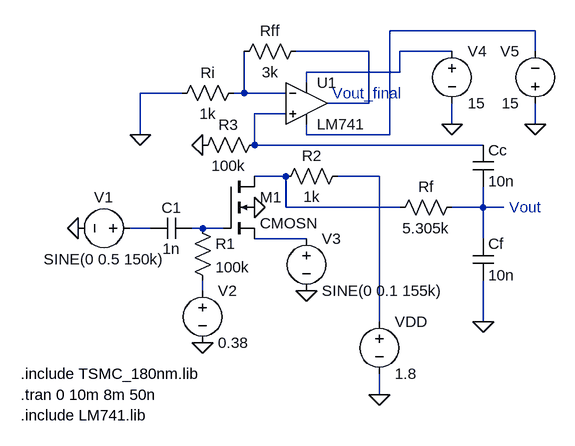
[diagram p0: schematic mixer+LPF+amplifier.asc]
mixer+LPF+amplifier.asc, the LTspice schematic file:
Version 4
SHEET 1 880 680
WIRE 640 -128 416 -128
WIRE 384 -96 272 -96
WIRE 512 -96 432 -96
WIRE 640 -96 640 -128
WIRE 432 -64 432 -96
WIRE 432 -64 288 -64
WIRE 288 -48 288 -64
WIRE 96 -32 32 -32
WIRE 192 -32 192 -96
WIRE 192 -32 176 -32
WIRE 256 -32 192 -32
WIRE 384 -16 384 -96
WIRE 384 -16 320 -16
WIRE 256 0 208 0
WIRE 512 16 512 -16
WIRE 640 16 640 -16
WIRE 32 32 32 -32
WIRE 288 32 288 16
WIRE 416 32 416 -128
WIRE 416 32 288 32
WIRE 208 48 208 0
WIRE 560 48 208 48
WIRE 256 96 208 96
WIRE 400 96 336 96
WIRE 256 144 256 96
WIRE 432 144 256 144
WIRE 560 144 560 112
WIRE 560 144 512 144
WIRE 592 144 560 144
WIRE 48 176 16 176
WIRE 128 176 112 176
WIRE 160 176 128 176
WIRE 288 192 208 192
WIRE 560 192 560 144
WIRE 128 272 128 256
WIRE 400 320 400 96
WIRE 560 320 560 256
WIRE 400 432 400 400
FLAG -64 176 0
FLAG 128 352 0
FLAG 288 272 0
FLAG 208 144 0
FLAG 560 320 0
FLAG 400 432 0
FLAG 32 32 0
FLAG 512 16 0
FLAG 640 16 0
FLAG 128 48 0
SYMBOL nmos4 160 96 R0
SYMATTR InstName M1
SYMATTR Value CMOSN
SYMATTR Value2 l=0.18u w=10u ad=5p as=5p pd=21u ps=21u
SYMBOL cap 112 160 R90
WINDOW 0 0 32 VBottom 2
WINDOW 3 32 32 VTop 2
SYMATTR InstName C1
SYMATTR Value 1n
SYMBOL res 112 160 R0
SYMATTR InstName R1
SYMATTR Value 100k
SYMBOL res 352 80 R90
WINDOW 0 0 56 VBottom 2
WINDOW 3 32 56 VTop 2
SYMATTR InstName R2
SYMATTR Value 1k
SYMBOL voltage 32 176 R90
WINDOW 0 -32 56 VBottom 2
WINDOW 3 32 56 VTop 2
WINDOW 123 0 0 Left 0
WINDOW 39 0 0 Left 0
SYMATTR InstName V1
SYMATTR Value SINE(0 0.5 150k)
SYMBOL voltage 128 256 R0
WINDOW 123 0 0 Left 0
WINDOW 39 0 0 Left 0
SYMATTR InstName V2
SYMATTR Value 0.38
SYMBOL voltage 288 176 R0
WINDOW 123 0 0 Left 0
WINDOW 39 0 0 Left 0
SYMATTR InstName V3
SYMATTR Value SINE(0 0.1 155k)
SYMBOL Res 528 128 R90
WINDOW 0 0 56 VBottom 2
WINDOW 3 32 56 VTop 2
SYMATTR InstName Rf
SYMATTR Value 5.305k
SYMBOL Cap 544 192 R0
SYMATTR InstName Cf
SYMATTR Value 10n
SYMBOL Voltage 400 304 R0
SYMATTR InstName VDD
SYMATTR Value 1.8
SYMBOL Cap 544 48 R0
SYMATTR InstName Cc
SYMATTR Value 10n
SYMBOL LM741 288 -80 R0
SYMATTR InstName U1
SYMBOL Res 192 -48 R90
WINDOW 0 0 56 VBottom 2
WINDOW 3 32 56 VTop 2
SYMATTR InstName Ri
SYMATTR Value 1k
SYMBOL Res 288 -112 R90
WINDOW 0 0 56 VBottom 2
WINDOW 3 32 56 VTop 2
SYMATTR InstName Rff
SYMATTR Value 3k
SYMBOL Voltage 512 -112 R0
SYMATTR InstName V4
SYMATTR Value 15
SYMBOL Voltage 640 0 R180
WINDOW 0 24 96 Left 2
WINDOW 3 24 16 Left 2
SYMATTR InstName V5
SYMATTR Value 15
SYMBOL Res 224 32 R90
WINDOW 0 0 56 VBottom 2
WINDOW 3 32 56 VTop 2
SYMATTR InstName R3
SYMATTR Value 100k
TEXT -152 400 Left 2 !.include TSMC_180nm.lib
TEXT -152 432 Left 2 !.tran 0 10m 8m 50n
TEXT -152 464 Left 2 !.include LM741.lib
TEXT 328 -32 Left 2 ;Vout_final
TEXT 600 144 Left 2 ;Vout

The netlist it stands for:
* mixer+LPF+amplifier.asc
M1 N006 N010 N011 0 CMOSN l=0.18u w=10u ad=5p as=5p pd=21u ps=21u
C1 N010 N009 1n
R1 N010 N012 100k
R2 N007 N006 1k
V1 N009 0 SINE(0 0.5 150k)
V2 N012 0 0.38
V3 N011 0 SINE(0 0.1 155k)
Rf N008 N006 5.305k
Cf N008 0 10n
VDD N007 0 1.8
Cc N005 N008 10n
XU1 N005 N004 N003 N001 N002 LM741  ; pins In+ In- V+ V- OUT
Ri N004 0 1k
Rff N002 N004 3k
V4 N003 0 15
V5 0 N001 15
R3 N005 0 100k
.model NMOS NMOS
.model PMOS PMOS
.lib standard.mos
.include TSMC_180nm.lib
.tran 0 10m 8m 50n
.include LM741.lib
* Vout_final
* Vout
.lib LM741.lib
.backanno
.end